# Altium project ws2812_2020_breakout.PrjPcb
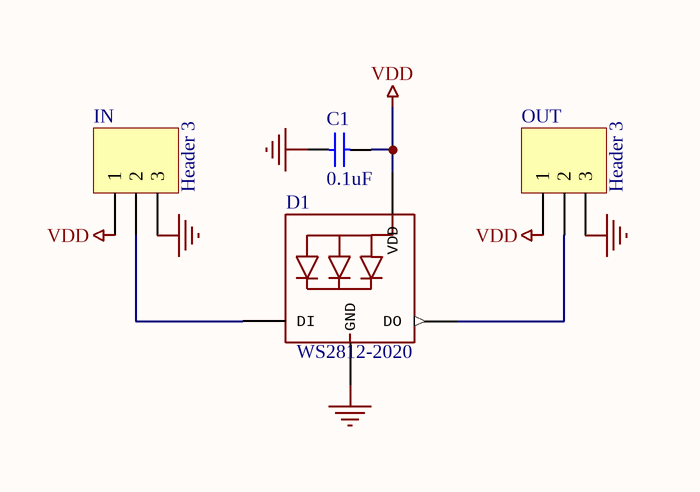
[diagram p0: ws2812_2020_breakout.SchDoc]
2 sheets, 8 parts. Net scope: global (net labels, ports and power ports of the same name join across sheets).
Board files: ws2812_2020_breakout.PcbDoc, ws2812_2020_breakout_mini.PcbDoc
Sheets:
  ws2812_2020_breakout.SchDoc
  ws2812_2020_breakout_mini.SchDoc

## Sheet ws2812_2020_breakout.SchDoc
size A

### Parts
C1  value 0.1uF  [CAP_0402R]
D1  WS2812-2020  [WS2812-2020]
IN  Header 3  [HDR1X3]
OUT  Header 3  [HDR1X3]

### Nets
GND: C1.1 D1.2(GND) IN.3 OUT.3
VDD: C1.2 D1.4(VDD) IN.1 OUT.1
NetD1_1: D1.1(DO) OUT.2
NetD1_3: D1.3(DI) IN.2

### Library data of the parts
C1 = CAP: Capacitor
D1 = WS2812-2020: Intelligent control LED integrated light source, low current, 2020 package; Manufacturer: Worldsemi; MPN: WS2812-2020
IN OUT = Header 3: Header, 3-Pin

## Sheet ws2812_2020_breakout_mini.SchDoc
size A
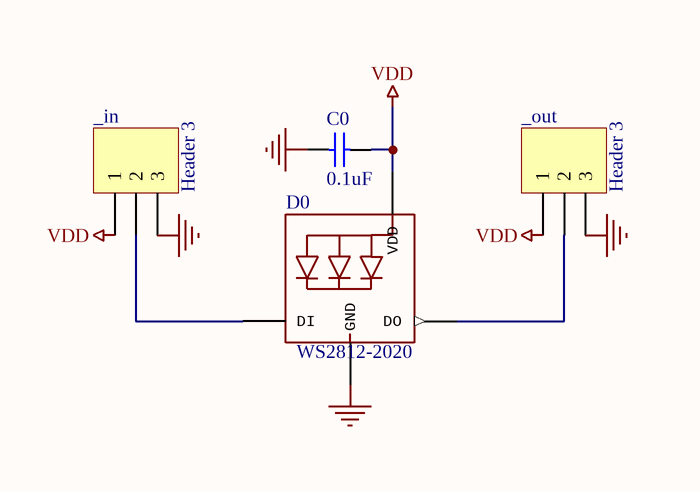
[diagram p1: ws2812_2020_breakout_mini.SchDoc]

### Parts
_in  Header 3  [HDR1X3_SWD]
_out  Header 3  [HDR1X3_SWD]
C0  value 0.1uF  [CAP_0402R]
D0  WS2812-2020  [WS2812-2020]

### Nets
GND: _in.3 _out.3 C0.1 D0.2(GND)
VDD: _in.1 _out.1 C0.2 D0.4(VDD)
Net_in_2: _in.2 D0.3(DI)
Net_out_2: _out.2 D0.1(DO)

### Library data of the parts
_in _out = Header 3: Header, 3-Pin
C0 = CAP: Capacitor
D0 = WS2812-2020: as D1 on sheet ws2812_2020_breakout; MPN: WS2812-2020

## Nets that join several sheets
GND: ws2812_2020_breakout (C1.1 D1.2 IN.3 OUT.3), ws2812_2020_breakout_mini (_in.3 _out.3 C0.1 D0.2)
VDD: ws2812_2020_breakout (C1.2 D1.4 IN.1 OUT.1), ws2812_2020_breakout_mini (_in.1 _out.1 C0.2 D0.4)